# Altium schematic sheet SIM.SchDoc
size Letter; Address1: L3, 12a Rodborough Rd; Address2: Frenchs Forest; Address3: NSW; Address4: Australia 2086
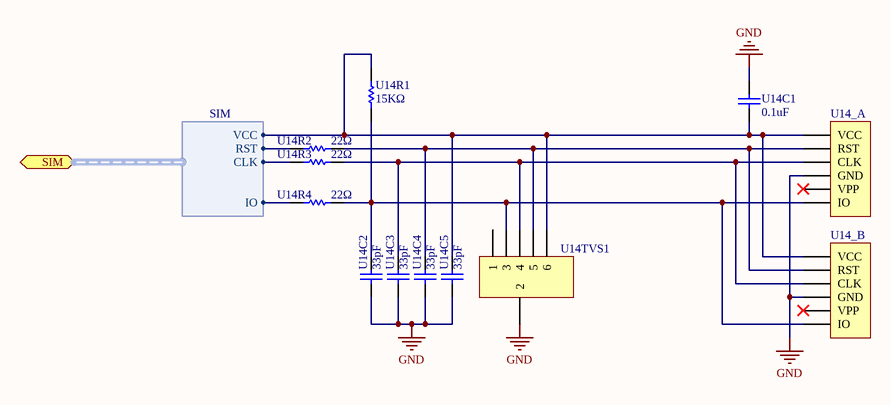
[diagram p0: SIM.SchDoc]

## Parts
U14_A  0786463001  [0786463001-SIM]  (value not drawn)
U14_B  7111S2015X02LF  [SIM-6]  (value not drawn)
U14C1  0.1uF  [0603 - CAP]
U14C2  33pF  [0805-cap]
U14C3  33pF  [0805-cap]
U14C4  33pF  [0805-cap]
U14C5  33pF  [0805-cap]
U14R1  15KΩ  [0805-RES]
U14R2  22Ω  [0805-RES]
U14R3  22Ω  [0805-RES]
U14R4  22Ω  [0805-RES]
U14TVS1  SMF05C.TCT  [SC70-6]  (value not drawn)

## Ports
SIM (harness SIM)

## Harnesses
SIM: VCC, IO, CLK, RST

## Nets
GND: U14_A.5(GND) U14_B.5(GND) U14C1.2 U14C2.1 U14C3.1 U14C4.1 U14C5.1 U14TVS1.2
NetU14_A_1: U14_A.1(VCC) U14_B.1(VCC) U14C1.1 U14C5.2 U14R1.1 U14TVS1.6 ; port SIM.VCC
NetU14_A_2: U14_A.2(RST) U14_B.2(RST) U14C4.2 U14R2.2 U14TVS1.5
NetU14_A_3: U14_A.3(CLK) U14_B.3(CLK) U14C3.2 U14R3.2 U14TVS1.4
NetU14_A_7: U14_A.7(IO) U14_B.7(IO) U14C2.2 U14R1.2 U14R4.2 U14TVS1.3
NetU14R2_1: U14R2.1 ; port SIM.RST
NetU14R3_1: U14R3.1 ; port SIM.CLK
NetU14R4_1: U14R4.1 ; port SIM.IO

Not connected (* = marked no-connect by the designer): U14_A 6(VPP)*; U14_B 6(VPP)*; U14TVS1 1

## Notes on the sheet
- Elaboró
- Fecha
- Nombre del artículo
- Revisó
- Aprobó
- Número de parte
- Revisión
- Escala
- N/A
- Sección afectada
- Descripción del cambio
- Lámina
- 1/1
- Tolerancias
- Ruta del archivo

## Library data of the parts
U14_A = Header 6: '6 Position Card Connector Micro SIM Surface Mount, Right Angle Gold; Manufacturer: Molex, LLC; Supplier 1: Digi-Key; Supplier Part Number 1: WM9364CT-ND; Manufacturer Part Number: 0786463001; Supplier 2: Mouser; Supplier Part Number 2: 538-78646-3001
U14_B = Header 6: 6 Position Card Connector SIM Card Surface Mount, Right Angle Gold; Manufacturer: Amphenol FCI; Supplier 1: Digi-Key; Supplier Part Number 1: 609-1401-1-ND; Manufacturer Part Number: 7111S2015X02LF
U14C1 = Cap: CAP CERAMIC 0.1UF, 25V, X7R, 0603; Manufacturer Part Number: CGJ3E2X7R1E104K080AA; Manufacturer: TDK Corporation; Value: 0.1uF; Supplier 1: Digi-Key; Supplier Part Number 1: 445-8129-1-ND
U14C2-U14C5 = Cap: 33pF 50V Ceramic Capacitor C0G, NP0 0805 (2012 Metric) 0.079" L x 0.049" W (2.00mm x 1.25mm); Manufacturer: Kemet; Manufacturer Part Number: C0805C330J5GACTU; Value: 33pF; Supplier 1: Digi-Key; Supplier Part Number 1: 399-1115-1-ND
U14R1 = Res1: RES SMD 15K OHM 1% 1/8W 0805; Manufacturer: Panasonic Electronic Components; Manufacturer Part Number: ERJ-6ENF1502V; Value: 15KΩ; Supplier 1: Digi-Key; Supplier Part Number 1: P15.0KCCT-ND
U14R2-U14R4 = Res1: RES SMD 22 OHM 1% 1/8W 0805; Manufacturer: Panasonic Electronic Components; Manufacturer Part Number: ERJ-6ENF22R0V; Value: 22Ω; Supplier 1: Digi-Key; Supplier Part Number 1: P22.0CCT-ND
U14TVS1 = Header 6: TVS DIODE 5V 12.5V SC70-6; Manufacturer: Semtech Corporation; Supplier 1: Digi-Key; Supplier Part Number 1: SMF05CCT-ND; Manufacturer Part Number: SMF05C.TCT